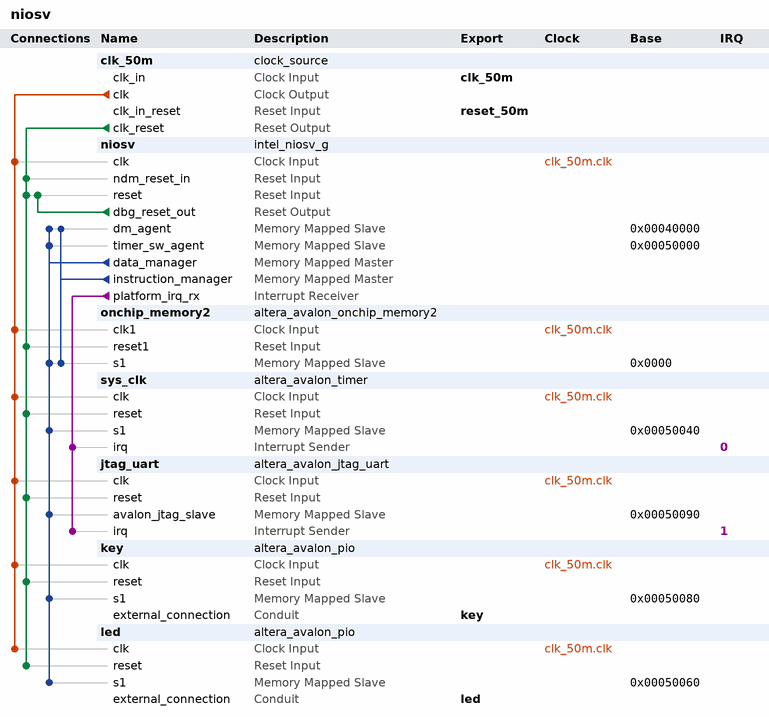
[diagram p0: system contents]
# Platform Designer (Qsys) system niosv, Cyclone V 5CSXFC6D6F31C8ES
# Parameters at their usual value, and those the tool derives, are not listed.
package require -exact qsys 23.1
create_system niosv
set_project_property DEVICE_FAMILY {Cyclone V}
set_project_property DEVICE 5CSXFC6D6F31C8ES

add_instance clk_50m clock_source 23.1
set_instance_parameter_value clk_50m clockFrequency 50000000

add_instance niosv intel_niosv_g 1.0.0
set_instance_parameter_value niosv clockFrequency 50000000
set_instance_parameter_value niosv dataCacheSize 4096
set_instance_parameter_value niosv dtcm1Base 0
set_instance_parameter_value niosv dtcm1Size 0
set_instance_parameter_value niosv dtcm2Base 0
set_instance_parameter_value niosv dtcm2Size 0
set_instance_parameter_value niosv enableDebug true
set_instance_parameter_value niosv enableDebugReset true
set_instance_parameter_value niosv enableECCLite false
set_instance_parameter_value niosv enableFPU false
set_instance_parameter_value niosv enableMulDiv true
set_instance_parameter_value niosv instCacheSize 4096
set_instance_parameter_value niosv itcm1Base 0
set_instance_parameter_value niosv itcm1Size 0
set_instance_parameter_value niosv itcm2Base 0
set_instance_parameter_value niosv itcm2Size 0
set_instance_parameter_value niosv peripheralRegionABase 0
set_instance_parameter_value niosv peripheralRegionASize 65536
set_instance_parameter_value niosv peripheralRegionBBase 0
set_instance_parameter_value niosv peripheralRegionBSize 0
set_instance_parameter_value niosv resetOffset 0
set_instance_parameter_value niosv resetSlave onchip_memory2.s1
set_instance_parameter_value niosv useResetReq false

add_instance onchip_memory2 altera_avalon_onchip_memory2 23.1
set_instance_parameter_value onchip_memory2 dataWidth 32
set_instance_parameter_value onchip_memory2 dualPort false
set_instance_parameter_value onchip_memory2 initMemContent true
set_instance_parameter_value onchip_memory2 initializationFileName hello.hex
set_instance_parameter_value onchip_memory2 memorySize 262144
set_instance_parameter_value onchip_memory2 useNonDefaultInitFile true

add_instance sys_clk altera_avalon_timer 23.1
set_instance_parameter_value sys_clk period 1
set_instance_parameter_value sys_clk periodUnits MSEC

add_instance jtag_uart altera_avalon_jtag_uart 23.1
set_instance_parameter_value jtag_uart simInteractiveOptions NO_INTERACTIVE_WINDOWS

add_instance key altera_avalon_pio 23.1
set_instance_parameter_value key direction Input
set_instance_parameter_value key width 1

add_instance led altera_avalon_pio 23.1
set_instance_parameter_value led bitModifyingOutReg true
set_instance_parameter_value led direction Output
set_instance_parameter_value led width 1

# connections
add_connection clk_50m.clk jtag_uart.clk clock
add_connection clk_50m.clk key.clk clock
add_connection clk_50m.clk led.clk clock
add_connection clk_50m.clk niosv.clk clock
add_connection clk_50m.clk onchip_memory2.clk1 clock
add_connection clk_50m.clk sys_clk.clk clock
add_connection clk_50m.clk_reset jtag_uart.reset reset
add_connection clk_50m.clk_reset key.reset reset
add_connection clk_50m.clk_reset led.reset reset
add_connection clk_50m.clk_reset niosv.ndm_reset_in reset
add_connection clk_50m.clk_reset niosv.reset reset
add_connection clk_50m.clk_reset onchip_memory2.reset1 reset
add_connection clk_50m.clk_reset sys_clk.reset reset
add_connection niosv.dbg_reset_out niosv.reset reset
add_connection niosv.data_manager jtag_uart.avalon_jtag_slave avalon
set_connection_parameter_value niosv.data_manager/jtag_uart.avalon_jtag_slave baseAddress 0x00050090
add_connection niosv.data_manager key.s1 avalon
set_connection_parameter_value niosv.data_manager/key.s1 baseAddress 0x00050080
add_connection niosv.data_manager led.s1 avalon
set_connection_parameter_value niosv.data_manager/led.s1 baseAddress 0x00050060
add_connection niosv.data_manager niosv.dm_agent avalon
set_connection_parameter_value niosv.data_manager/niosv.dm_agent baseAddress 0x00040000
add_connection niosv.data_manager niosv.timer_sw_agent avalon
set_connection_parameter_value niosv.data_manager/niosv.timer_sw_agent baseAddress 0x00050000
add_connection niosv.data_manager onchip_memory2.s1 avalon
set_connection_parameter_value niosv.data_manager/onchip_memory2.s1 baseAddress 0x0000
add_connection niosv.data_manager sys_clk.s1 avalon
set_connection_parameter_value niosv.data_manager/sys_clk.s1 baseAddress 0x00050040
add_connection niosv.instruction_manager niosv.dm_agent avalon
set_connection_parameter_value niosv.instruction_manager/niosv.dm_agent baseAddress 0x00040000
add_connection niosv.instruction_manager onchip_memory2.s1 avalon
set_connection_parameter_value niosv.instruction_manager/onchip_memory2.s1 baseAddress 0x0000
add_connection niosv.platform_irq_rx jtag_uart.irq interrupt
set_connection_parameter_value niosv.platform_irq_rx/jtag_uart.irq irqNumber 1
add_connection niosv.platform_irq_rx sys_clk.irq interrupt
set_connection_parameter_value niosv.platform_irq_rx/sys_clk.irq irqNumber 0

# exported interfaces
add_interface clk_50m clock sink
set_interface_property clk_50m EXPORT_OF clk_50m.clk_in
add_interface key conduit end
set_interface_property key EXPORT_OF key.external_connection
add_interface led conduit end
set_interface_property led EXPORT_OF led.external_connection
add_interface reset_50m reset sink
set_interface_property reset_50m EXPORT_OF clk_50m.clk_in_reset

set_interconnect_requirement {$system} qsys_mm.clockCrossingAdapter HANDSHAKE
set_interconnect_requirement {$system} qsys_mm.enableEccProtection FALSE
set_interconnect_requirement {$system} qsys_mm.insertDefaultSlave FALSE
set_interconnect_requirement {$system} qsys_mm.maxAdditionalLatency 1

save_system niosv.qsys
